# EAGLE design RPiWirelessGateway (EAGLE 6.2)
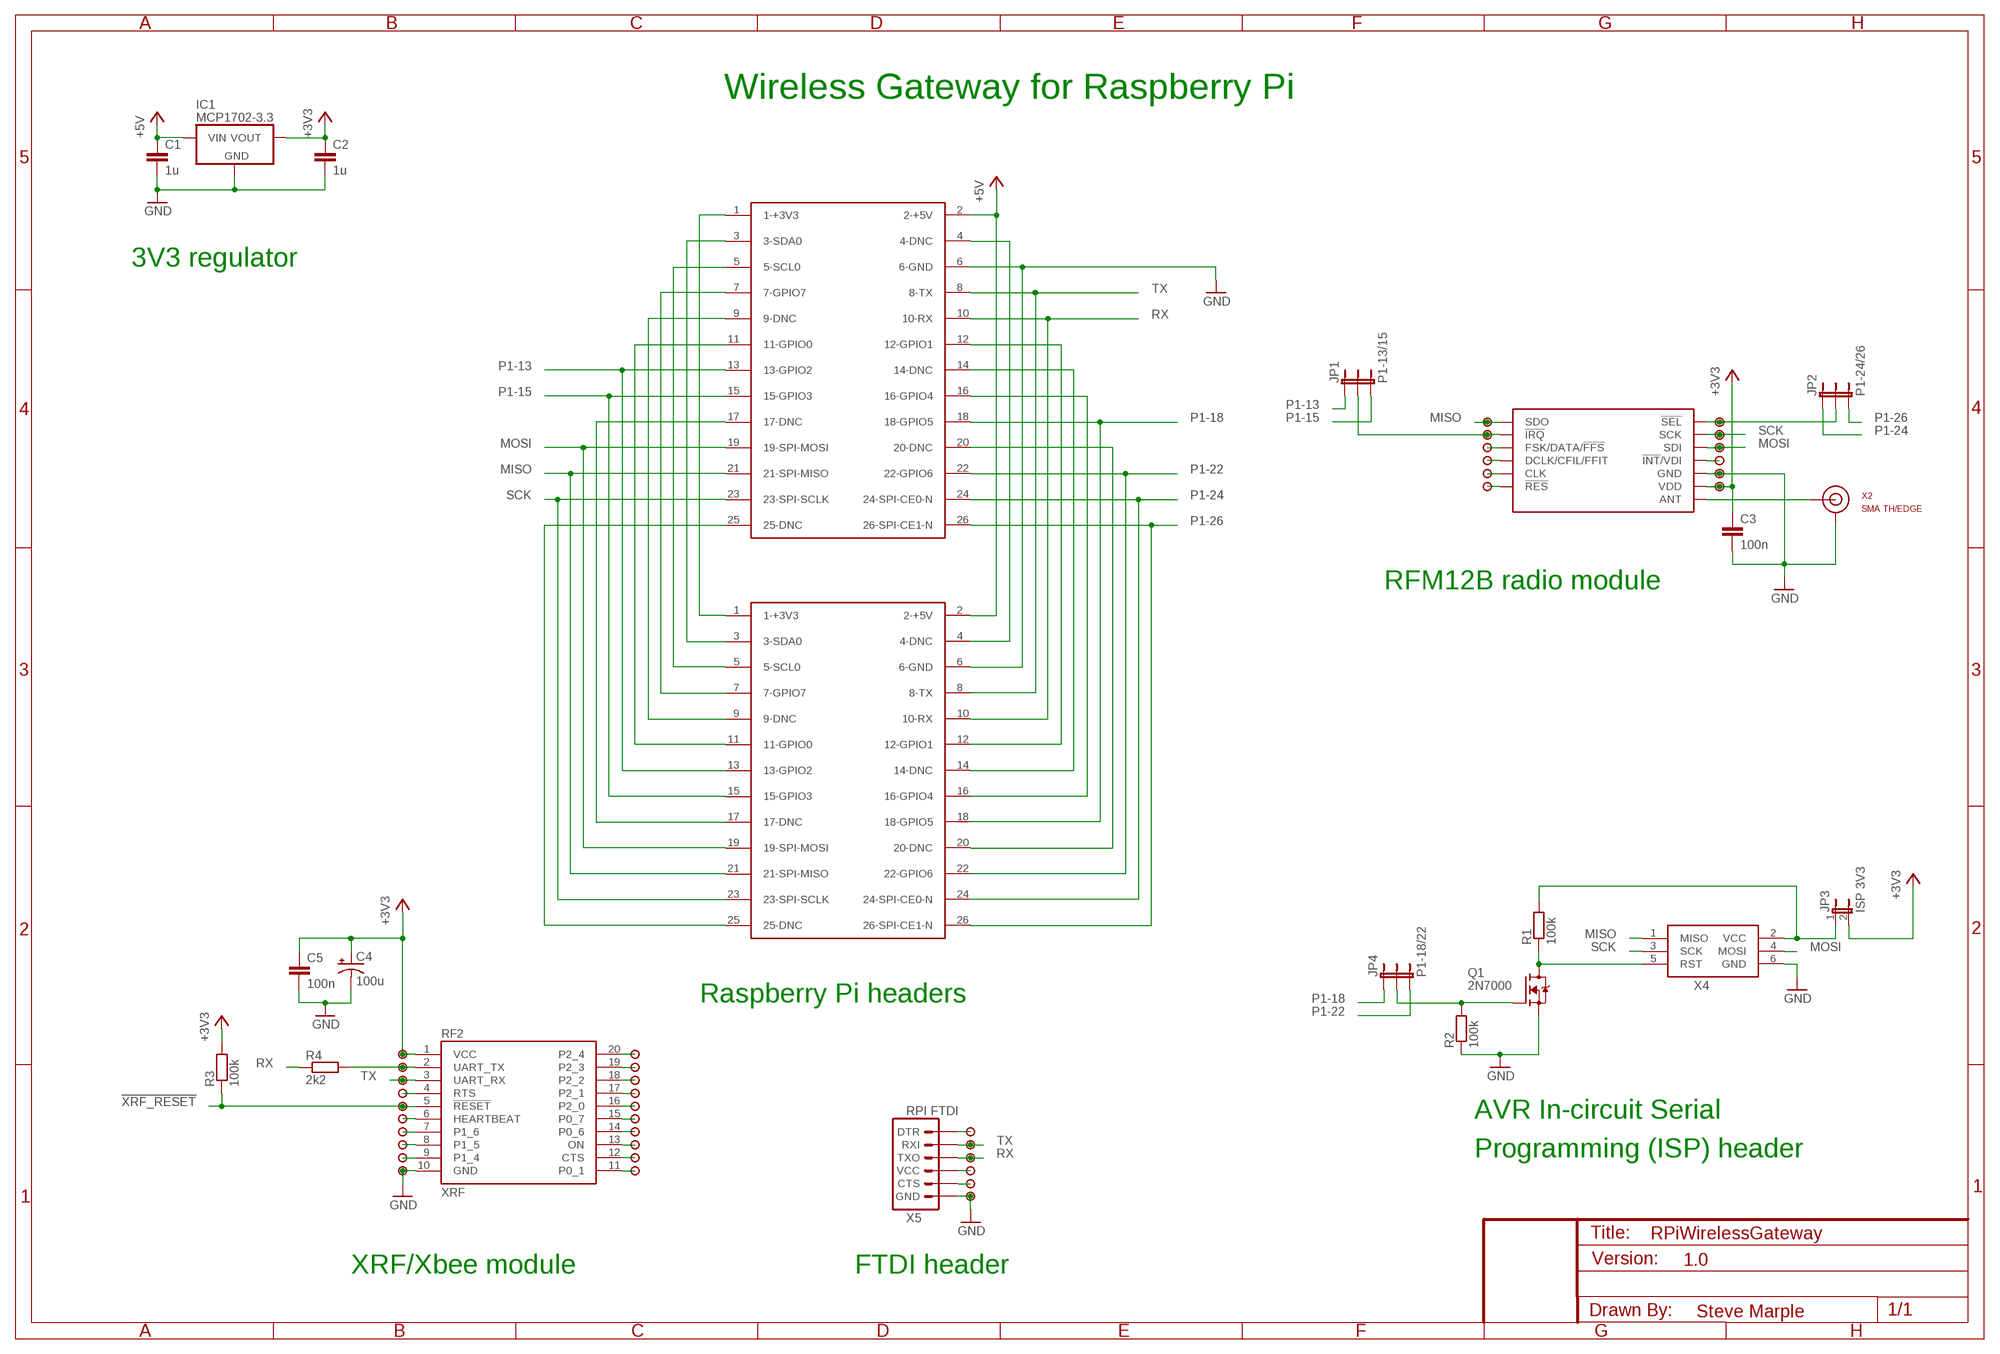
[diagram p0: schematic, sheet 1]

## Parts
C1  1u  CAPPTH1  [CAP-PTH-5MM]
C2  1u  CAPPTH1  [CAP-PTH-5MM]
C3  100n  CAPPTH  [CAP-PTH-SMALL]
C4  100u  CAP_POLPTH2  [CPOL-RADIAL-10UF-25V]
C5  100n  CAPPTH  [CAP-PTH-SMALL]
IC1  MCP1702-3.3  MCP1702  [TO-92]
JP1  P1-13/15  JUMPER-3PTH  [1X03]
JP2  P1-24/26  JUMPER-3PTH  [1X03]
JP3  ISP 3V3  JUMPER-2PTH  [1X02]
JP4  P1-18/22  JUMPER-3PTH  [1X03]
PAD_RFM12B_!INT!/VDI  PAD  [PAD]
PAD_RFM12B_!INT!/VDI1  PAD  [PAD]
PAD_RFM12B_!INT!/VDI2  PAD  [PAD]
PAD_RFM12B_!IRQ  PAD  [PAD]
PAD_RFM12B_!RESET  PAD  [PAD]
PAD_RFM12B_!SEL  PAD  [PAD]
PAD_RFM12B_CLK  PAD  [PAD]
PAD_RFM12B_DCLK/CFIL/!FFS  PAD  [PAD]
PAD_RFM12B_FSK/DATA/!FFS  PAD  [PAD]
PAD_RFM12B_SCK  PAD  [PAD]
PAD_RFM12B_SDI  PAD  [PAD]
PAD_RFM12B_SDO  PAD  [PAD]
Q1  2N7000  [TO-92]
R1  100k  RESISTOR  [RES-AXIAL-0.4]
R2  100k  RESISTOR  [RES-AXIAL-0.4]
R3  100k  RESISTOR  [RES-AXIAL-0.4]
R4  2k2  RESISTOR  [RES-AXIAL-0.4]
RF1  RFM12B  RFM12BSMD  [RFM12B]
RF2  XRF  XRFB1  [XBEE]
U$1  PAD  [PAD]
U$2  PAD  [PAD]
U$3  PAD  [PAD]
U$4  PAD  [PAD]
U$5  PAD  [PAD]
U$6  PAD  [PAD]
U$7  PAD  [PAD]
U$8  PAD  [PAD]
U$9  PAD  [PAD]
U$10  PAD  [PAD]
U$11  PAD  [PAD]
U$12  PAD  [PAD]
U$13  PAD  [PAD]
U$14  PAD  [PAD]
U$15  PAD  [PAD]
U$16  PAD  [PAD]
U$17  PAD  [PAD]
U$18  PAD  [PAD]
U$19  PAD  [PAD]
U$20  PAD  [PAD]
U$21  PAD  [PAD]
U$22  PAD  [PAD]
U$23  PAD  [PAD]
U$24  PAD  [PAD]
U$25  PAD  [PAD]
U$26  PAD  [PAD]
X1  P1A  RASPBERRY-PIHEADER  [RASPBERRY-PI-HEADER]
X2  SMA TH/EDGE  CONN-SMATHD-SMD-EDGE  [SMA-THD-EDGE]
X3  P1B  RASPBERRY-PIHEADER  [RASPBERRY-PI-HEADER]
X4  AVR ISP  AVRISP-HEADER-6-SHROUDED  [CONN-HARTING-ML6]
X5  RPI FTDI  ARDUINO_SERIAL_PROGRAMPTH-KIT  [1X06-KIT]

## Nets
!XRF_RESET: R3.P$1 RF2.5(!RESET) U$9.1
+3V3 [power]: C2.1 C3.1 C4.1(+) C5.1 IC1.3(VOUT) JP3.2 PAD_RFM12B_!INT!/VDI2.1 R3.P$2 RF1.VDD RF2.1(VCC) U$1.1
+5V [5V]: C1.1 IC1.2(VIN) X1.2(2-+5V) X3.2(2-+5V)
GND [power]: C1.2 C2.2 C3.2 C4.2(-) C5.2 IC1.1(GND) PAD_RFM12B_!INT!/VDI1.1 Q1.1(S) R2.P$1 RF1.GND@0(GND) RF1.GND@1(GND) RF2.10(GND) U$22.1 U$26.1 X1.6(6-GND) X2.GND@0(GND) X2.GND@1(GND) X2.GND@2(GND) X2.GND@3(GND) X2.GND@EDGE0(GND) X2.GND@EDGE1(GND) X2.GND@EDGE2(GND) X2.GND@EDGE3(GND) X3.6(6-GND) X4.6(GND) X5.6(GND)
MISO: PAD_RFM12B_SDO.1 RF1.SDO X1.21(21-SPI-MISO) X3.21(21-SPI-MISO) X4.1(MISO)
MOSI: PAD_RFM12B_SDI.1 RF1.SDI X1.19(19-SPI-MOSI) X3.19(19-SPI-MOSI) X4.4(MOSI)
N$1 [antenna]: RF1.ANT X2.SIG(SIGNAL) X2.SIG@EDGE(SIGNAL)
N$2: JP2.2 PAD_RFM12B_!SEL.1 RF1.!SEL
N$3: RF2.4(RTS) U$7.1
N$4: JP3.1 R1.P$2 X4.2(VCC)
N$5: RF2.6(HEARTBEAT) U$11.1
N$6: RF2.7(P1_6) U$13.1
N$7: RF2.8(P1_5) U$16.1
N$8: RF2.9(P1_4) U$19.1
N$9: RF2.11(P0_1) U$23.1
N$10: RF2.12(CTS) U$20.1
N$11: RF2.13(ON) U$17.1
N$12: RF2.14(P0_6) U$14.1
N$13: RF2.15(P0_7) U$12.1
N$14: RF2.16(P2_0) U$10.1
N$15: RF2.17(P2_1) U$8.1
N$16: RF2.18(P2_2) U$6.1
N$17: RF2.19(P2_3) U$4.1
N$18: RF2.20(P2_4) U$2.1
N$19: PAD_RFM12B_!INT!/VDI.1 RF1.!INT!/VDI
N$20: PAD_RFM12B_FSK/DATA/!FFS.1 RF1.FSK/DATA/!FFS
N$21: PAD_RFM12B_DCLK/CFIL/!FFS.1 RF1.DCLK/CFIL/FFIT
N$22: PAD_RFM12B_CLK.1 RF1.CLK
N$23: PAD_RFM12B_!RESET.1 RF1.!RES
N$24: Q1.3(D) R1.P$1 X4.5(RST)
N$25: X1.3(3-SDA0) X3.3(3-SDA0)
N$26: X1.5(5-SCL0) X3.5(5-SCL0)
N$27: X1.7(7-GPIO7) X3.7(7-GPIO7)
N$28: X1.9(9-DNC) X3.9(9-DNC)
N$29: X1.11(11-GPIO0) X3.11(11-GPIO0)
N$30: U$25.1 X5.5(CTS)
N$31: U$24.1 X5.4(VCC)
N$32: X1.17(17-DNC) X3.17(17-DNC)
N$33: X1.4(4-DNC) X3.4(4-DNC)
N$34: X1.25(25-DNC) X3.25(25-DNC)
N$35: X1.12(12-GPIO1) X3.12(12-GPIO1)
N$36: X1.14(14-DNC) X3.14(14-DNC)
N$37: X1.16(16-GPIO4) X3.16(16-GPIO4)
N$38: JP4.2 Q1.2(G) R2.P$2
N$39: X1.20(20-DNC) X3.20(20-DNC)
N$40: U$15.1 X5.1(DTR)
N$41 [power]: X1.1(1-+3V3) X3.1(1-+3V3)
N$42: R4.P$2 RF2.2(UART_TX) U$3.1
P1-13: JP1.1 X1.13(13-GPIO2) X3.13(13-GPIO2)
P1-13/15: JP1.2 PAD_RFM12B_!IRQ.1 RF1.!IRQ
P1-15: JP1.3 X1.15(15-GPIO3) X3.15(15-GPIO3)
P1-18: JP4.1 X1.18(18-GPIO5) X3.18(18-GPIO5)
P1-22: JP4.3 X1.22(22-GPIO6) X3.22(22-GPIO6)
P1-24: JP2.1 X1.24(24-SPI-CE0-N) X3.24(24-SPI-CE0-N)
P1-26: JP2.3 X1.26(26-SPI-CE1-N) X3.26(26-SPI-CE1-N)
RX: R4.P$1 U$21.1 X1.10(10-RX) X3.10(10-RX) X5.3(TXO)
SCK: PAD_RFM12B_SCK.1 RF1.SCK X1.23(23-SPI-SCLK) X3.23(23-SPI-SCLK) X4.3(SCK)
TX: RF2.3(UART_RX) U$5.1 U$18.1 X1.8(8-TX) X3.8(8-TX) X5.2(RXI)

## Notes on the sheet
- Wireless Gateway for Raspberry Pi
- 3V3 regulator
- RFM12B radio module
- Raspberry Pi headers
- AVR In-circuit Serial
- Programming (ISP) header
- 1.0
- XRF/Xbee module | FTDI header
- Steve Marple

## Library data of the parts
C1-C3 C5 = SparkFun:CAP: Capacitor Standard 0603 ceramic capacitor, and 0.1" leaded capacitor.
C4 = SparkFun:CAP_POL: Capacitor Polarized These are standard SMD and PTH capacitors. Normally 10uF, 47uF, and 100uF in electrolytic and tantalum varieties. Always verify the external diameter of the through hole cap, it varies with capacity, voltage, and manufacturer. The EIA devices should be standard.
IC1 = SteveMarple:MCP1702: Microchip MCP1702 250mA loq quiescent current (2uA) LDO voltage regulator.
JP1 JP2 JP4 = SparkFun:JUMPER-3
JP3 = SparkFun:JUMPER-2: Jumper Basic 0.1" spaced jumper. Use with breakaway headers.
PAD_RFM12B_!INT!/VDI PAD_RFM12B_!INT!/VDI1 PAD_RFM12B_!INT!/VDI2 PAD_RFM12B_!IRQ PAD_RFM12B_!RESET PAD_RFM12B_!SEL PAD_RFM12B_CLK PAD_RFM12B_DCLK/CFIL/!FFS PAD_RFM12B_FSK/DATA/!FFS PAD_RFM12B_SCK PAD_RFM12B_SDI PAD_RFM12B_SDO U$1-U$26 = SteveMarple:PAD
Q1 = SteveMarple:2N7000: 2N7000 FET
R1-R4 = SteveMarple:RESISTOR: 1/4W PTH resistor
RF1 = SteveMarple:RFM12B: RFM12B radio module by HopeRF
RF2 = SteveMarple:XRF
X1 X3 = SteveMarple:RASPBERRY-PI: Raspberry Pi Board <http://www.raspberrypi.org/> Jacques Lagnel V1.0 (beta) 2012 Board dimension: Forum 3D model <http://www.raspberrypi.org/forum/general-discussion/mechanical-profile-3d-models?value=3d%20model&type=1&include=1&search=1&ret=all> The GPIO Connector (P1): http://elinux.org/RPi_Low-level_peripherals
X2 = SteveMarple:CONN-SMA: SMA connector
X4 = SteveMarple:AVRISP: AVR ISP HEADER Standard 6 pin header for AVR programming
X5 = SparkFun:ARDUINO_SERIAL_PROGRAM

## Net classes
2 5V: width 0.381 mm
3 antenna: width 0.61 mm

## Board
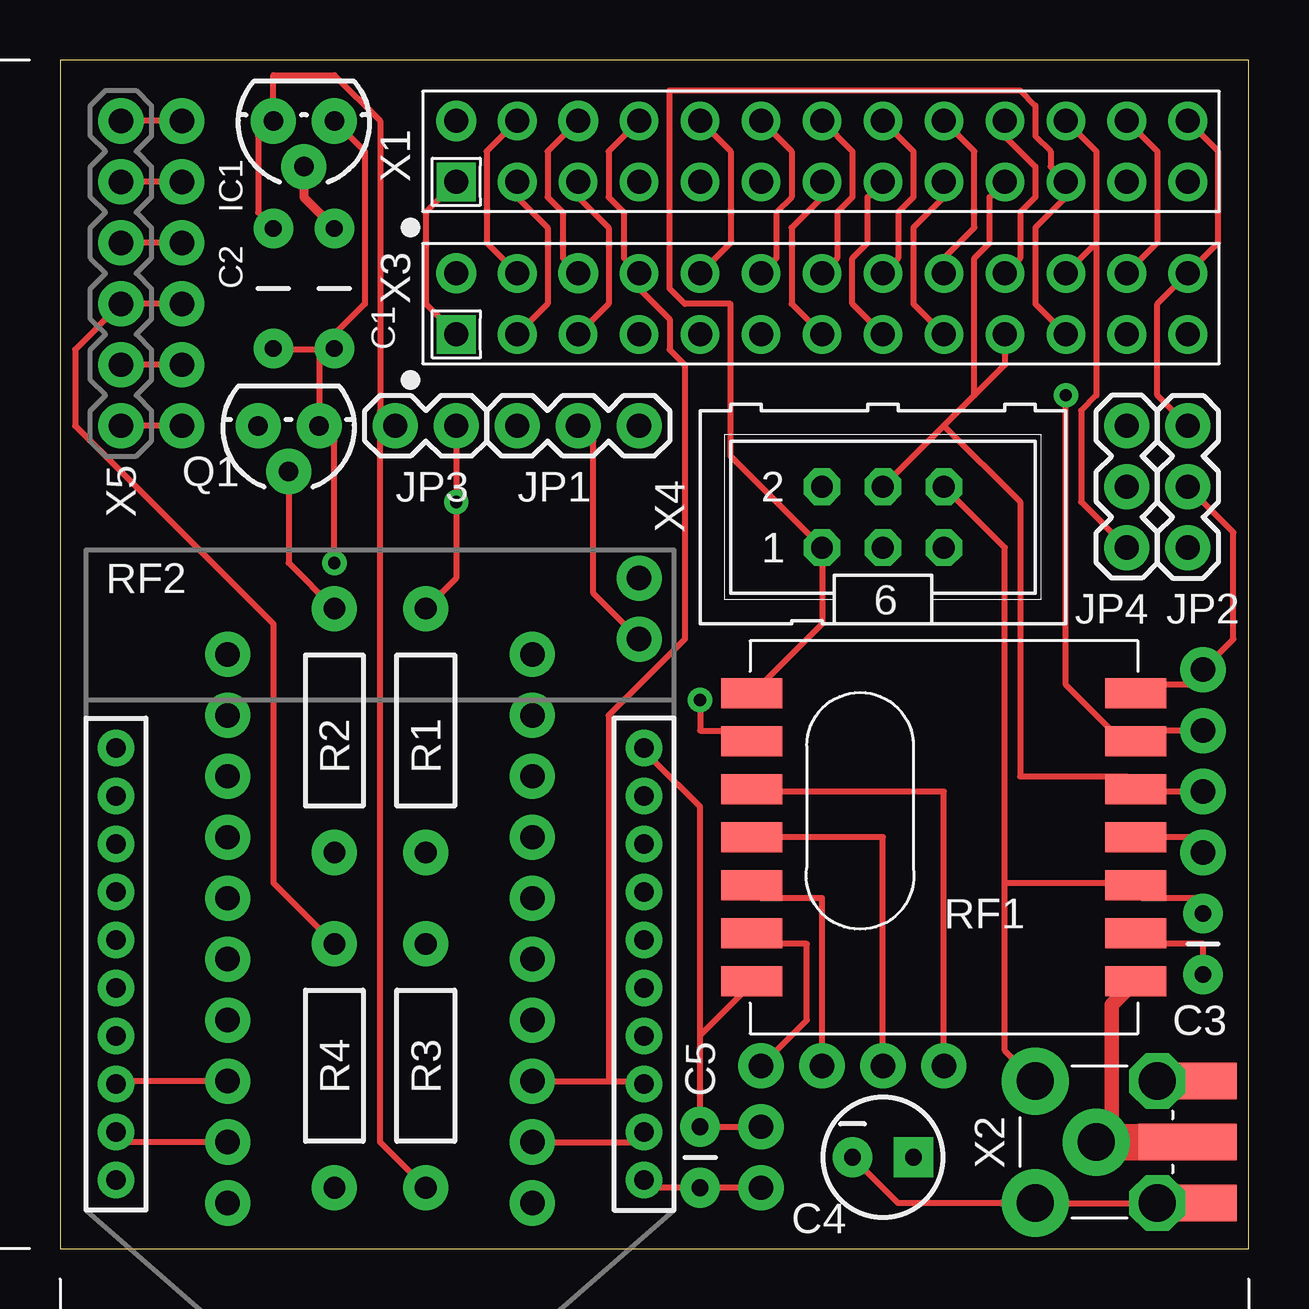
[diagram p1: board, top side]
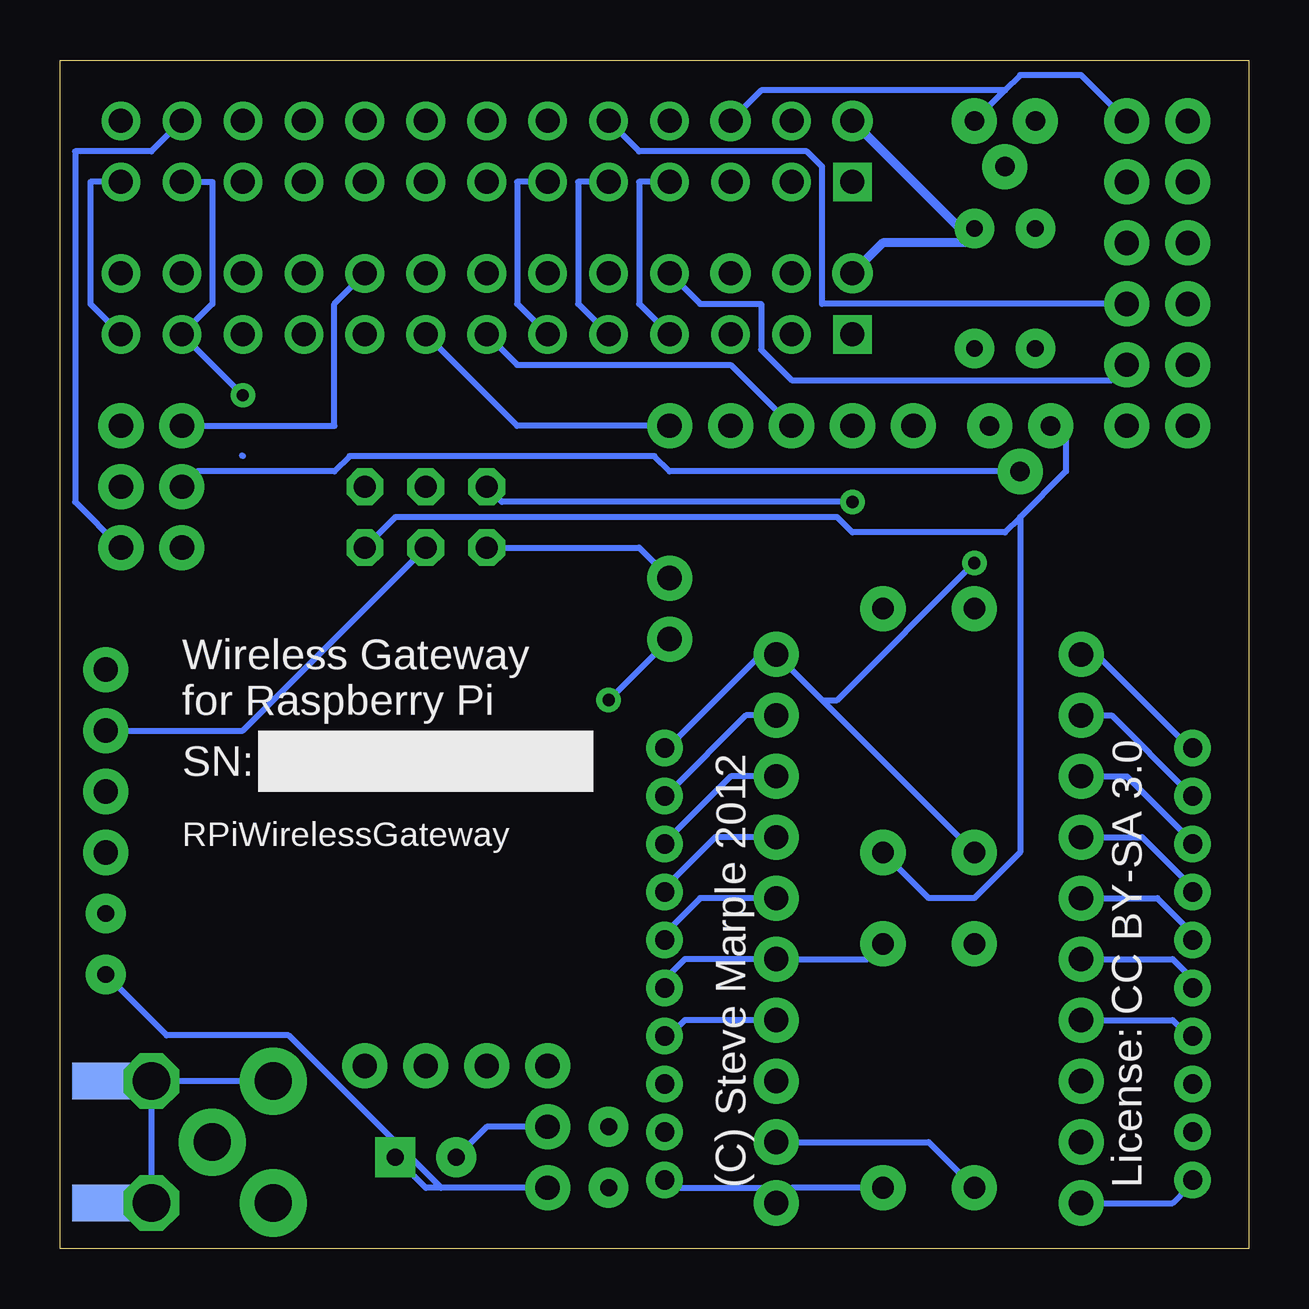
[diagram p2: board, bottom side, seen from below]

Size 49.53 x 49.53 mm. Coordinates in mm from the lower left corner, seen from the top.
Outline: 0,0 49.53,0 49.53,49.53 0,49.53 0,0
Copper layers (1*16): Top 0.035mm / dielectric 1.5mm / Bottom 0.035mm
Design rules: minimum track width 10mil, minimum drill 20mil, track to track 10mil, track to pad 10mil, pad to pad 10mil, via to via 10mil, smd to smd 10mil, copper to edge 10mil, drill to drill 8mil, minimum pad ring 12mil, minimum via ring 10mil, stop-mask expansion 4mil, vias tented up to drill 25mil, thermal gap 10mil
tRestrict: area 40,3.8 to 41.3,5.1
bRestrict: area 40,3.8 to 41.3,5.1

### Footprints (pad centres in the part's own frame; a part is rotated, then mirrored left to right if it is on the bottom)
CAP-PTH-5MM = drill 0.7 pad 1.651: 1 -2.5,0; 2 2.5,0
CAP-PTH-SMALL = drill 0.7 pad 1.651: 1 0,0; 2 2.54,0
CPOL-RADIAL-10UF-25V = drill 0.7 pad 1.651 square: 1 1.27,0 | drill 0.7 pad 1.651: 2 -1.27,0
TO-92 = drill 0.813 pad 1.88: 1 -1.27,0; 2 0,1.905; 3 1.27,0
1X03 = drill 1.016 pad 1.88: 1 0,0; 2 2.54,0; 3 5.08,0
1X02 = drill 1.016 pad 1.88: 1 0,0; 2 2.54,0
PAD = drill 1.016 pad 1.88: 1 0,0
RES-AXIAL-0.4 = drill 0.9 pad 1.88: P$1 -5.08,0; P$2 5.08,0
RFM12B = smd 2.54 x 1.27: !INT!/VDI 8,0; !IRQ -8,4; !RES -8,-4; !SEL 8,6; ANT 8,-6; CLK -8,-2; DCLK/CFIL/FFIT -8,0; FSK/DATA/!FFS -8,2; GND@0 -8,-6; GND@1 8,-2; SCK 8,4; SDI 8,2; SDO -8,6; VDD 8,-4
XBEE = drill 0.8 pad 1.524: 1 -11,20; 2 -11,18; 3 -11,16; 4 -11,14; 5 -11,12; 6 -11,10; 7 -11,8; 8 -11,6; 9 -11,4; 10 -11,2; 11 11,2; 12 11,4; 13 11,6; 14 11,8; 15 11,10; 16 11,12; 17 11,14; 18 11,16; 19 11,18; 20 11,20
RASPBERRY-PI-HEADER = drill 1 square: 1 0,0 | drill 1 pad 1.676: 2 0,2.54; 6 5.08,2.54 | drill 1: 3 2.54,0; 4 2.54,2.54; 5 5.08,0; 7 7.62,0; 8 7.62,2.54; 9 10.16,0; 10 10.16,2.54; 11 12.7,0; 12 12.7,2.54; 13 15.24,0; 14 15.24,2.54; 15 17.78,0; 16 17.78,2.54; 17 20.32,0; 18 20.32,2.54; 19 22.86,0; 20 22.86,2.54; 21 25.4,0; 22 25.4,2.54; 23 27.94,0; 24 27.94,2.54; 25 30.48,0; 26 30.48,2.54
SMA-THD-EDGE = drill 1.549 pad 2.794: GND@0 -2.54,2.54; GND@1 2.54,2.54; SIG 0,0 | drill 1.549 pad 2.184 octagon: GND@2 2.54,-2.54; GND@3 -2.54,-2.54 | smd 1.524 x 4.064: GND@EDGE0 -2.54,-3.81; GND@EDGE1 2.54,-3.81; SIG@EDGE 0,-3.81 | smd 1.524 x 4.064 bottom: GND@EDGE2 -2.54,-3.81; GND@EDGE3 2.54,-3.81
CONN-HARTING-ML6 = drill 0.914 octagon: 1 -2.54,-1.27; 2 -2.54,1.27; 3 0,-1.27; 4 0,1.27; 5 2.54,-1.27; 6 2.54,1.27
1X06-KIT = drill 1.016 pad 1.88: 1 0,0; 2 2.54,0; 3 5.08,0; 4 7.62,0; 5 10.16,0; 6 12.7,0

### Placement (x,y rotation side)
C1  11.43,40.01 270 top
C2  8.89,40.01 270 top
C3  47.62,11.43 90 top
C4  34.29,3.81 0 top
C5  26.67,2.54 90 top
IC1  10.16,46.99 180 top
JP1  19.05,34.29 0 top
JP2  46.99,29.21 90 top
JP3  16.51,34.29 180 top
JP4  44.45,34.29 270 top
PAD_RFM12B_!INT!/VDI  47.62,16.51 0 top
PAD_RFM12B_!INT!/VDI1  29.21,5.08 0 top
PAD_RFM12B_!INT!/VDI2  29.21,2.54 0 top
PAD_RFM12B_!IRQ  24.13,25.4 0 top
PAD_RFM12B_!RESET  29.21,7.62 0 top
PAD_RFM12B_!SEL  47.62,24.13 0 top
PAD_RFM12B_CLK  31.75,7.62 0 top
PAD_RFM12B_DCLK/CFIL/!FFS  34.29,7.62 0 top
PAD_RFM12B_FSK/DATA/!FFS  36.83,7.62 0 top
PAD_RFM12B_SCK  47.62,21.59 0 top
PAD_RFM12B_SDI  47.62,19.05 0 top
PAD_RFM12B_SDO  24.13,27.94 0 top
Q1  9.53,34.29 180 top
R1  15.24,21.59 90 top
R2  11.43,21.59 90 top
R3  15.24,7.62 270 top
R4  11.43,7.62 270 top
RF1  36.83,17.14 0 top
RF2  13.34,22.86 180 top
U$1  19.68,1.91 180 top
U$2  6.99,1.91 180 top
U$3  19.68,4.45 180 top
U$4  6.99,4.45 180 top
U$5  19.68,6.99 180 top
U$6  6.99,6.99 180 top
U$7  19.68,9.53 180 top
U$8  6.99,9.53 180 top
U$9  19.68,12.06 180 top
U$10  6.99,12.06 180 top
U$11  19.68,14.61 180 top
U$12  6.99,14.61 180 top
U$13  19.68,17.14 180 top
U$14  6.99,17.14 180 top
U$15  5.08,34.29 0 top
U$16  19.68,19.68 180 top
U$17  6.99,19.68 180 top
U$18  5.08,36.83 0 top
U$19  19.68,22.23 180 top
U$20  6.99,22.23 180 top
U$21  5.08,39.37 0 top
U$22  19.68,24.77 180 top
U$23  6.99,24.77 180 top
U$24  5.08,41.91 0 top
U$25  5.08,44.45 0 top
U$26  5.08,46.99 0 top
X1  16.51,44.45 0 top
X2  43.18,4.45 90 top
X3  16.51,38.1 0 top
X4  34.29,30.48 0 top
X5  2.54,34.29 90 top

### Tracks (layer width: path | path; a pad name or v marks a point on that pad's centre or on a via)
!XRF_RESET
  Bottom 0.254: RF2.5 24.13,11.43 23.5,12.06 U$9.1 15.88,12.06 R3.P$1
+3V3
  Top 0.254: C2.1 8.89,42.55 8.26,43.18 8.26,46.35 IC1.3 8.89,48.9 11.43,48.9 13.34,46.99 13.34,34.92 JP3.2 13.34,33.66 13.34,4.45 R3.P$2 | C3.1 47.62,12.7 45.09,12.7 RF1.VDD | RF2.1 24.77,2.54 C5.1 PAD_RFM12B_!INT!/VDI2.1
  Bottom 0.254: R3.P$2 19.05,2.54 U$1.1 20.32,2.54 24.13,2.54 RF2.1 | C4.1 34.29,2.54 33.66,2.54 | PAD_RFM12B_!INT!/VDI2.1 33.66,2.54 | C3.1 45.09,8.89 40.01,8.89 33.66,2.54
+5V
  Top 0.381: IC1.2 10.16,43.81 11.43,42.55 C1.1
  Bottom 0.381: X3.2 15.24,41.91 11.43,41.91 C1.1 11.43,42.55 12.06,42.55 X1.2
GND  (via drill 0.51)
  Top 0.254: X3.6 20.95,41.27 20.95,43.18 20.32,43.81 20.32,45.72 X1.6 | 10.79,37.47 11.43,37.47 C1.2 | 10.79,37.47 8.89,37.47 C2.2 | 10.79,37.47 Q1.1 11.43,33.66 v11.43,28.57 | 10.79,37.47 C1.2 | U$26.1 X5.6 | IC1.1 12.7,45.72 12.7,39.37 11.43,38.1 C1.2 | 29.21,11.43 RF1.GND@0 28.57,10.79 26.67,8.89 | 26.67,8.89 C5.2 PAD_RFM12B_!INT!/VDI1.1 | X2.GND@EDGE2 X2.GND@3 X2.GND@0 34.92,1.91 C4.2 | X2.GND@2 X2.GND@EDGE3 | 45.09,15.24 RF1.GND@1 | C3.2 47.62,14.61 45.09,14.61 RF1.GND@1 | X4.6 39.37,29.21 39.37,15.24 | 39.37,15.24 39.37,8.26 X2.GND@1 | 39.37,15.24 44.45,15.24 RF1.GND@1 | 26.67,8.89 26.67,18.41 24.77,20.32 RF2.10
  Bottom 0.254: 10.16,48.26 9.53,48.9 6.99,48.9 U$26.1 | 10.16,48.26 IC1.1 | X1.6 20.32,48.26 10.16,48.26 | RF2.10 24.13,20.95 20.32,24.77 U$22.1 17.78,22.86 | 17.78,22.86 R2.P$1 | C4.2 31.75,5.08 PAD_RFM12B_!INT!/VDI1.1 | X2.GND@EDGE2 X2.GND@3 X2.GND@2 | X2.GND@2 X2.GND@EDGE3 | X2.GND@1 X2.GND@2 | v11.43,28.57 17.14,22.86 17.78,22.86
MISO
  Top 0.254: X3.21 40.64,39.37 40.64,42.55 41.91,43.81 X1.21 41.27,45.09 41.27,45.72 40.64,46.35 40.64,47.62 40.01,48.26 25.4,48.26 25.4,40.01 26.04,39.37 27.94,39.37 27.94,33.02 X4.1 31.75,26.04 29.21,23.5 RF1.SDO
  Bottom 0.254: PAD_RFM12B_SDO.1 25.4,29.21 X4.1
MOSI
  Top 0.254: PAD_RFM12B_SDI.1 45.09,19.05 RF1.SDI 44.45,19.68 40.01,19.68 40.01,31.11 36.83,34.29 | 38.1,35.56 39.37,36.83 X3.19 | 38.1,35.56 36.83,34.29 | 36.83,34.29 X4.4 | X1.19 38.73,43.81 38.73,41.91 38.1,41.27 38.1,35.56
N$1
  Top 0.61: RF1.ANT 44.45,10.79 43.81,10.16 43.81,5.08 X2.SIG
N$2
  Top 0.254: RF1.!SEL 45.09,23.5 47.62,23.5 PAD_RFM12B_!SEL.1 48.9,25.4 48.9,29.84 JP2.2
N$3
  Bottom 0.254: U$7.1 23.5,9.53 24.13,8.89 RF2.4
N$4  (via drill 0.51)
  Top 0.254: JP3.1 v16.51,31.11 16.51,27.94 R1.P$2
  Bottom 0.254: X4.2 31.11,31.11 v16.51,31.11
N$5
  Bottom 0.254: U$11.1 22.86,14.61 24.13,13.34 RF2.6
N$6
  Bottom 0.254: U$13.1 22.23,17.14 24.13,15.24 RF2.7
N$7
  Bottom 0.254: U$16.1 21.59,19.68 24.13,17.14 RF2.8
N$8
  Bottom 0.254: U$19.1 20.95,22.23 24.13,19.05 RF2.9
N$9
  Bottom 0.254: U$23.1 6.35,24.77 2.54,20.95 RF2.11
N$10
  Bottom 0.254: U$20.1 5.71,22.23 2.54,19.05 RF2.12
N$11
  Bottom 0.254: U$17.1 5.08,19.68 2.54,17.14 RF2.13
N$12
  Bottom 0.254: U$14.1 4.45,17.14 2.54,15.24 RF2.14
N$13
  Bottom 0.254: U$12.1 3.81,14.61 2.54,13.34 RF2.15
N$14
  Bottom 0.254: U$10.1 3.17,12.06 2.54,11.43 RF2.16
N$15
  Bottom 0.254: U$8.1 3.17,9.53 2.54,8.89 RF2.17
N$16
  Top 0.254: U$6.1 2.54,6.99 RF2.18
N$17
  Top 0.254: U$4.1 2.54,4.45 RF2.19
N$18
  Bottom 0.254: U$2.1 3.17,1.91 2.54,2.54 RF2.20
N$19
  Top 0.254: RF1.!INT!/VDI 47.62,17.14 PAD_RFM12B_!INT!/VDI.1
N$20
  Top 0.254: PAD_RFM12B_FSK/DATA/!FFS.1 36.83,19.05 29.21,19.05 RF1.FSK/DATA/!FFS
N$21
  Top 0.254: RF1.DCLK/CFIL/FFIT 34.29,17.14 PAD_RFM12B_DCLK/CFIL/!FFS.1
N$22
  Top 0.254: PAD_RFM12B_CLK.1 31.75,14.61 29.21,14.61 RF1.CLK
N$23
  Top 0.254: PAD_RFM12B_!RESET.1 31.11,9.53 31.11,12.7 29.21,12.7 RF1.!RES
N$24
  Bottom 0.254: X4.5 35.56,30.48 17.14,30.48 16.51,29.84 10.16,29.84 9.53,30.48 | 9.53,30.48 7.62,32.38 7.62,34.29 Q1.3 | R1.P$1 13.34,14.61 11.43,14.61 9.53,16.51 9.53,30.48
N$25
  Top 0.254: X3.3 20.32,39.37 20.32,42.55 19.05,43.81 X1.3
N$26
  Top 0.254: X3.5 22.86,39.37 22.86,42.55 21.59,43.81 X1.5
N$27
  Bottom 0.254: X3.7 25.4,39.37 25.4,44.45 X1.7
N$28
  Bottom 0.254: X3.9 27.94,39.37 27.94,44.45 X1.9
N$29
  Bottom 0.254: X3.11 30.48,39.37 30.48,44.45 X1.11
N$30
  Top 0.254: U$25.1 X5.5
N$31
  Top 0.254: U$24.1 X5.4
N$32
  Top 0.254: X3.17 35.56,39.37 35.56,42.55 36.83,43.81 X1.17
N$33
  Top 0.254: X3.4 17.78,41.91 17.78,45.72 X1.4
N$34
  Bottom 0.254: X3.25 48.26,39.37 48.26,44.45 X1.25
N$35
  Top 0.254: X3.12 29.84,41.27 29.84,43.18 30.48,43.81 30.48,45.72 X1.12
N$36
  Top 0.254: X3.14 32.38,41.27 32.38,43.18 33.02,43.81 33.02,45.72 X1.14
N$37
  Top 0.254: X3.16 34.92,41.27 34.92,43.18 35.56,43.81 35.56,45.72 X1.16
N$38
  Top 0.254: R2.P$2 9.53,28.57 Q1.2
  Bottom 0.254: JP4.2 43.81,32.38 38.1,32.38 37.47,33.02 24.77,33.02 24.13,32.38 Q1.2
N$39
  Top 0.254: X3.20 40.01,41.27 40.01,43.18 40.64,43.81 40.64,45.09 39.37,46.35 X1.20
N$40
  Top 0.254: U$15.1 X5.1
N$41
  Top 0.254: X3.1 15.24,39.37 15.24,43.18 X1.1
N$42
  Top 0.254: U$3.1 24.13,4.45 RF2.2
  Bottom 0.254: R4.P$2 13.34,4.45 U$3.1
N$43
  Bottom 0.254: 41.91,33.02 41.94,33.05
P1-13
  Top 0.254: X3.13 30.48,39.37 30.48,42.55 31.75,43.81 X1.13
  Bottom 0.254: JP1.1 21.59,36.83 30.48,36.83 X3.13
P1-13/15  (via drill 0.51)
  Top 0.254: v26.67,22.86 26.67,21.59 28.57,21.59 RF1.!IRQ | JP1.2 22.23,33.66 22.23,27.3 PAD_RFM12B_!IRQ.1
  Bottom 0.254: PAD_RFM12B_!IRQ.1 v26.67,22.86
P1-15
  Top 0.254: X1.15 33.66,43.81 33.66,41.91 33.02,41.27 33.02,39.37 X3.15
  Bottom 0.254: X3.15 30.48,34.29 JP1.3
P1-18
  Top 0.254: X1.18 38.1,45.72 38.1,42.55 36.83,41.27 X3.18
  Bottom 0.254: X3.18 38.1,39.37 38.1,34.29 JP4.1
P1-22
  Top 0.254: 43.18,41.91 X3.22 | 43.18,41.91 43.18,45.72 X1.22 | JP4.3 42.55,31.11 42.55,34.92 43.18,35.56 43.18,41.91
P1-24
  Top 0.254: X3.24 45.72,41.91 45.72,45.72 X1.24
  Bottom 0.254: JP2.1 48.9,31.11 48.9,45.72 45.72,45.72 X1.24
P1-26
  Top 0.254: JP2.3 45.72,35.56 45.72,39.37 X3.26 48.26,41.91 48.26,45.72 X1.26
RX
  Top 0.254: X3.10 27.94,41.91 27.94,45.72 X1.10 | U$21.1 X5.3 0.64,37.47 0.64,34.29 8.89,26.04 8.89,15.24 R4.P$1
  Bottom 0.254: X1.10 25.4,45.72 18.41,45.72 17.78,45.09 17.78,39.37 U$21.1
SCK  (via drill 0.51)
  Top 0.254: PAD_RFM12B_SCK.1 45.09,21.59 RF1.SCK 44.45,20.95 41.91,23.5 v41.91,35.56
  Bottom 0.254: X1.23 43.18,44.45 43.18,39.37 X3.23 v41.91,35.56 | X4.3 41.91,21.59 PAD_RFM12B_SCK.1
TX
  Top 0.254: U$5.1 22.86,6.99 | 22.86,6.99 24.13,6.99 RF2.3 | U$18.1 X5.2 | X1.8 22.86,45.72 22.86,43.81 23.5,43.18 23.5,41.27 X3.8 24.13,40.01 25.4,38.73 25.4,37.47 26.04,36.83 26.04,25.4 22.86,22.23 22.86,6.99
  Bottom 0.254: U$18.1 5.71,36.2 19.05,36.2 20.32,37.47 20.32,39.37 22.86,39.37 X3.8

### Text on the board
tNames: TODO | Check jumper labels correspond with position | Tidy silkscreen layout | Fix minor layout issues | Check final routing for antenna | Add ground pour with .024" isolation | Add +3V3 pour near XRF with .024" isolation? | Check all footprints | Check RFM12B fouling against AVR ISP and SMA | PRELIMINARY
bNames: Wireless Gateway | for Raspberry Pi | SN: | License: CC BY-SA 3.0 | (C) Steve Marple 2012